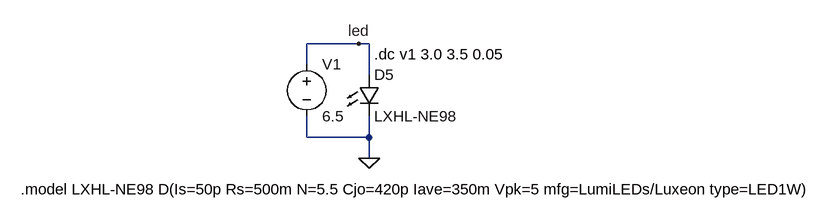
[diagram p0: schematic tstNE981.asc]
tstNE981.asc, the LTspice schematic file:
Version 4
SHEET 1 1744 680
WIRE 864 224 784 224
WIRE 880 224 864 224
WIRE 784 256 784 224
WIRE 880 272 880 224
WIRE 784 368 784 336
WIRE 880 368 880 336
WIRE 880 368 784 368
WIRE 880 400 880 368
FLAG 880 400 0
FLAG 864 224 led
SYMBOL LED 864 272 R0
SYMATTR InstName D5
SYMATTR Value LXHL-NE98
SYMBOL voltage 784 240 R0
SYMATTR InstName V1
SYMATTR Value 6.5
TEXT 344 448 Left 0 !.model LXHL-NE98 D(Is=50p Rs=500m N=5.5 Cjo=420p Iave=350m Vpk=5 mfg=LumiLEDs/Luxeon type=LED1W)
TEXT 888 240 Left 0 !.dc v1 3.0 3.5 0.05

The netlist it stands for:
* tstNE981.asc
D5 led 0 LXHL-NE98
V1 led 0 6.5
.model D D
.lib standard.dio
.model LXHL-NE98 D(Is=50p Rs=500m N=5.5 Cjo=420p Iave=350m Vpk=5 mfg=LumiLEDs/Luxeon type=LED1W)
.dc v1 3.0 3.5 0.05
.backanno
.end